# EAGLE design pH-meter-v1-3 (EAGLE 6.1)
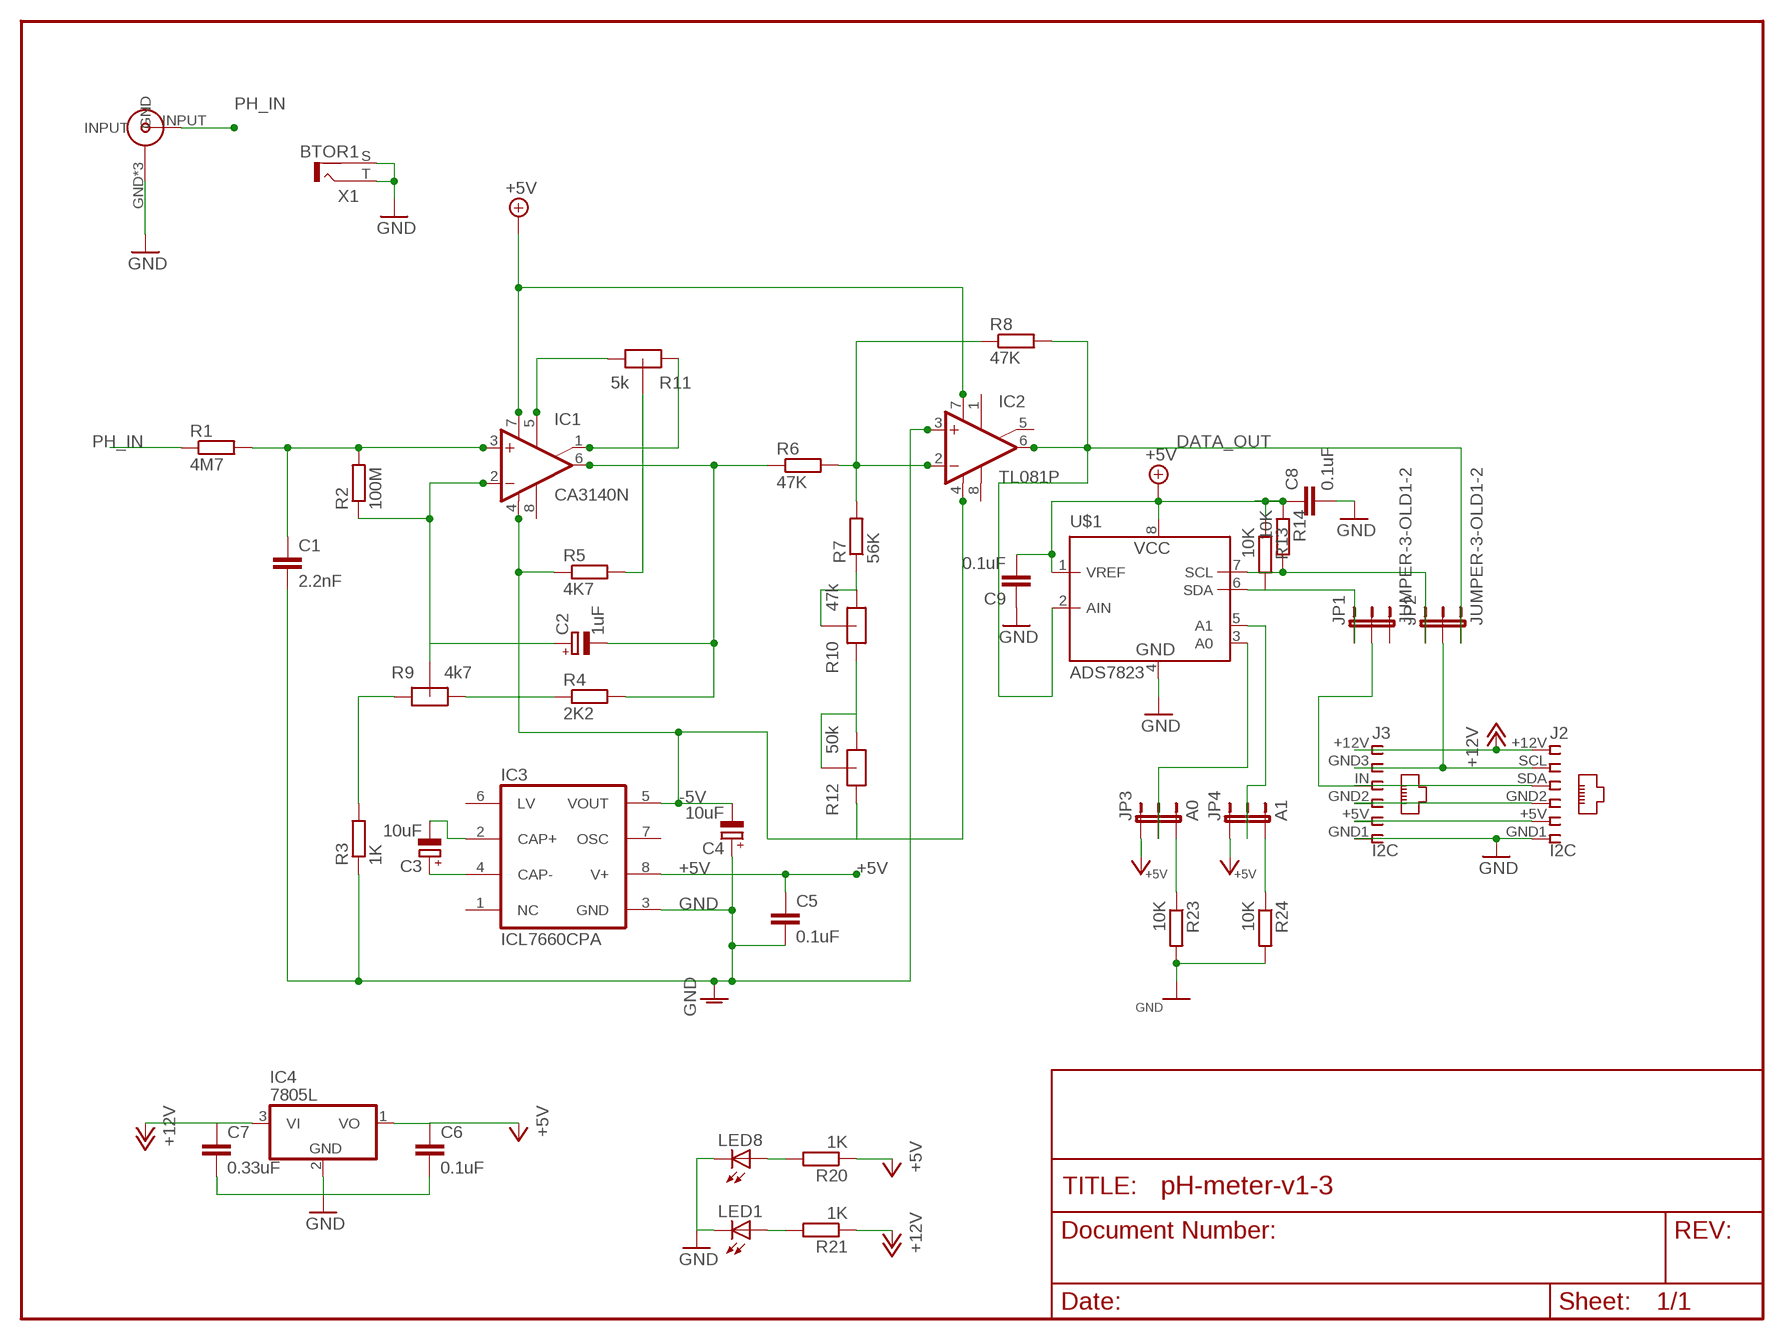
[diagram p0: schematic, sheet 1]

## Parts
C1  2.2nF  C-EU025-030X050  [C025-030X050]
C2  1uF  CPOL-EUE2-4  [E2-4]
C3  10uF  CPOL-EUE2-4  [E2-4]
C4  10uF  CPOL-EUE2-4  [E2-4]
C5  0.1uF  C-EU025-030X050  [C025-030X050]
C6  0.1uF  C-EU025-030X050  [C025-030X050]
C7  0.33uF  C-EU025-030X050  [C025-030X050]
C8  0.1uF  C-EU025-030X050  [C025-030X050]
C9  0.1uF  C-EU025-030X050  [C025-030X050]
IC1  CA3140N  [DIL08]
IC2  TL081P  [DIL08]
IC3  ICL7660CPA  [DIL08]
IC4  7805L  [TO92]
J2  I2C  RJ12STRAIGHT-I2C  [RJ12-STRAIGHT-I2C]
J3  I2C  RJ12STRAIGHT-ANALOG  [RJ12-STRAIGHT-ANALOG]
JP1  JUMPER-3-OLD1-2  [SJ_3_PASTE1&2]
JP2  JUMPER-3-OLD1-2  [SJ_3_PASTE1&2]
JP3  A0  JUMPER-3-OLD1-2  [SJ_3_PASTE1&2]
JP4  A1  JUMPER-3-OLD1-2  [SJ_3_PASTE1&2]
LED1  LED3MM  [LED3MM]
LED8  LED3MM  [LED3MM]
R1  4M7  R-EU_0309/12  [0309/12]
R2  100M  R-EU_0309/12  [0309/12]
R3  1K  R-EU_0309/12  [0309/12]
R4  2K2  R-EU_0309/12  [0309/12]
R5  4K7  R-EU_0309/12  [0309/12]
R6  47K  R-EU_0309/12  [0309/12]
R7  56K  R-EU_0309/12  [0309/12]
R8  47K  R-EU_0309/12  [0309/12]
R9  4k7  POT-METER_ALPS  [POT-METER_ALPS]
R10  47k  POT-METER_ALPS  [POT-METER_ALPS]
R11  5k  POT-METER_ALPS  [POT-METER_ALPS]
R12  50k  POT-METER_ALPS  [POT-METER_ALPS]
R13  10K  R-EU_R1206  [R1206]
R14  10K  R-EU_R1206  [R1206]
R20  1K  R-EU_0309/12  [0309/12]
R21  1K  R-EU_0309/12  [0309/12]
R23  10K  R-EU_0309/12  [0309/12]
R24  10K  R-EU_0309/12  [0309/12]
U$1  ADS7823  [MSOP8]
U$2  BNC_IN  BND_VERTICAL_AMPHENOL  [BNC_VERTICAL_AMPHENOL]
X1  BTOR1  [BTOR1]

## Nets
+5V: C5.1 C6.1 C8.1 C9.2 IC1.7(V+) IC2.7(V+) IC3.8(V+) IC4.1(VO) JP3.1 JP4.1 R13.1 R14.1 R20.1 U$1.1(VREF) U$1.8(VCC)
+12V [highpower]: C7.1 IC4.3(VI) J2.+12V J3.+12V R21.1
-5V: C4.- IC1.4(V-) IC2.4(V-) IC3.5(VOUT) R5.1 R12.P$1(IN)
ASDF: R3.2 R9.P$1(IN)
DATA_OUT [smd]: IC2.6(OUT) JP2.3 R8.2 U$1.2(AIN)
GND [highpower]: C1.2 C4.+ C5.2 C6.2 C7.2 C8.2 C9.1 IC2.3(+IN) IC3.3(GND) IC4.2(GND) J2.GND1 J2.GND2 J3.GND1 J3.GND2 LED1.K(C) LED8.K(C) R3.1 R23.2 R24.2 U$1.4(GND) U$2.GND U$2.GND_1(GND) U$2.GND_2(GND) X1.S X1.T
N$1: C1.1 IC1.3(+IN) R1.2 R2.2
N$2: C2.+ IC1.2(-IN) R2.1 R9.P$2(DRIVE)
N$3: R5.2 R11.P$2(DRIVE)
N$4: IC1.5(ON) R11.P$3(OUT)
N$5: IC1.1(ON/CMP) R11.P$1(IN)
N$6: C2.- IC1.6(OUT) R4.2 R6.1
N$7: R4.1 R9.P$3(OUT)
N$8: R7.1 R10.P$2(DRIVE) R10.P$3(OUT)
N$10: R10.P$1(IN) R12.P$2(DRIVE) R12.P$3(OUT)
N$11: C3.- IC3.2(CAP+)
N$12: IC2.2(-IN) R6.2 R7.2 R8.1
N$13: C3.+ IC3.4(CAP-)
N$14 [smd]: JP1.1 R13.2 U$1.6(SDA)
N$15 [smd]: JP2.1 R14.2 U$1.7(SCL)
N$18 [smd]: JP3.3 R23.1
N$19 [smd]: JP4.3 R24.1
N$20: LED8.A R20.2
N$21 [smd]: JP3.2 U$1.3(A0)
N$22 [smd]: JP4.2 U$1.5(A1)
N$23: LED1.A R21.2
PH_IN: R1.1 U$2.INPUT
RJ12-5V [highpower]: J2.+5V J3.+5V
SCL [smd]: J2.SCL J3.GND3 JP2.2
SDA [smd]: J2.SDA J3.IN JP1.2
Unconnected: IC1.8(CMP) IC2.1(ON1) IC2.5(ON2) IC2.8(OPT) IC3.1(NC) IC3.6(LV) IC3.7(OSC) JP1.3 X1.S@1 X1.S@2 X1.S@3

## Library data of the parts
C1 C5-C9 = resistor:C-EU: CAPACITOR, European symbol
C2-C4 = resistor:CPOL-EU: POLARIZED CAPACITOR, European symbol
IC1 = linear:CA3140: OP AMP
IC2 = linear:TL081: OP AMP
IC3 = maxim:ICL7660CPA: VOLTAGE CONVERTER; MF: INTERSIL; MPN: ICL7660CPA; OC_FARNELL: 1018170; OC_NEWARK: 06F7441
IC4 = linear:78*: Positive VOLTAGE REGULATOR Source: http://cache.national.com/ds/LM/LM78L05.pdf http://www.fairchildsemi.com/ds/LM/LM7805.pdf
J2 J3 = lpatiny:RJ12: CORCOM Modular RJ Jacks No Shield Source: www.tycoelectronics.com .. ENG_DS_1654001_1099_RJ_L_0507.pdf
JP1-JP4 = SparkFun:JUMPER-3-OLD
LED1 LED8 = lpatiny:LED3MM
R1-R8 R13 R14 R20 R21 R23 R24 = rcl:R-EU_: RESISTOR, European symbol
R9-R12 = lpatiny:POT-METER_ALPS
U$1 = lpatiny:ADS7823
U$2 = lpatiny:BND_VERTICAL_AMPHENOL
X1 = con-lumberg:BTOR1: RCA connectors according to JEITA RC-5231 Cinch RCA-Einbaukupplung nach JEITA RC-5231, stehende Ausführung Source: http://www.lumberg.de/Produkte/PDFs/BTOR1.pdf; MPN: BTOR 1; OC_FARNELL: 1217030; OC_NEWARK: 96K7172

## Net classes
0 default: width 0.457 mm
1 smd: width 0.203 mm
2 highpower: width 0.61 mm

## Board
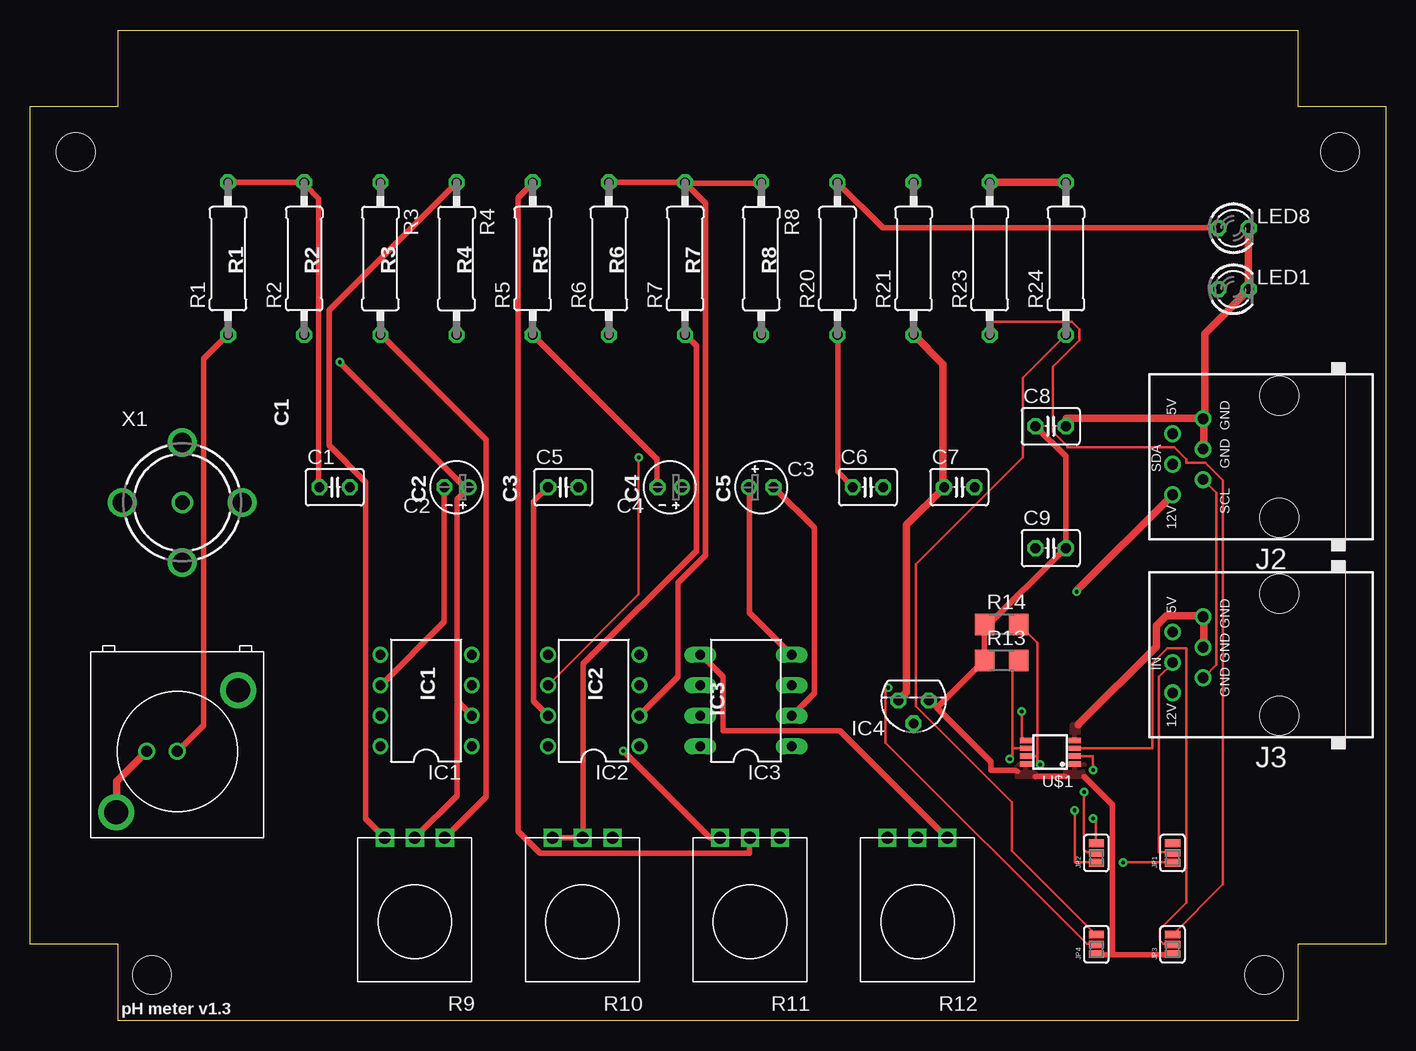
[diagram p1: board, top side]
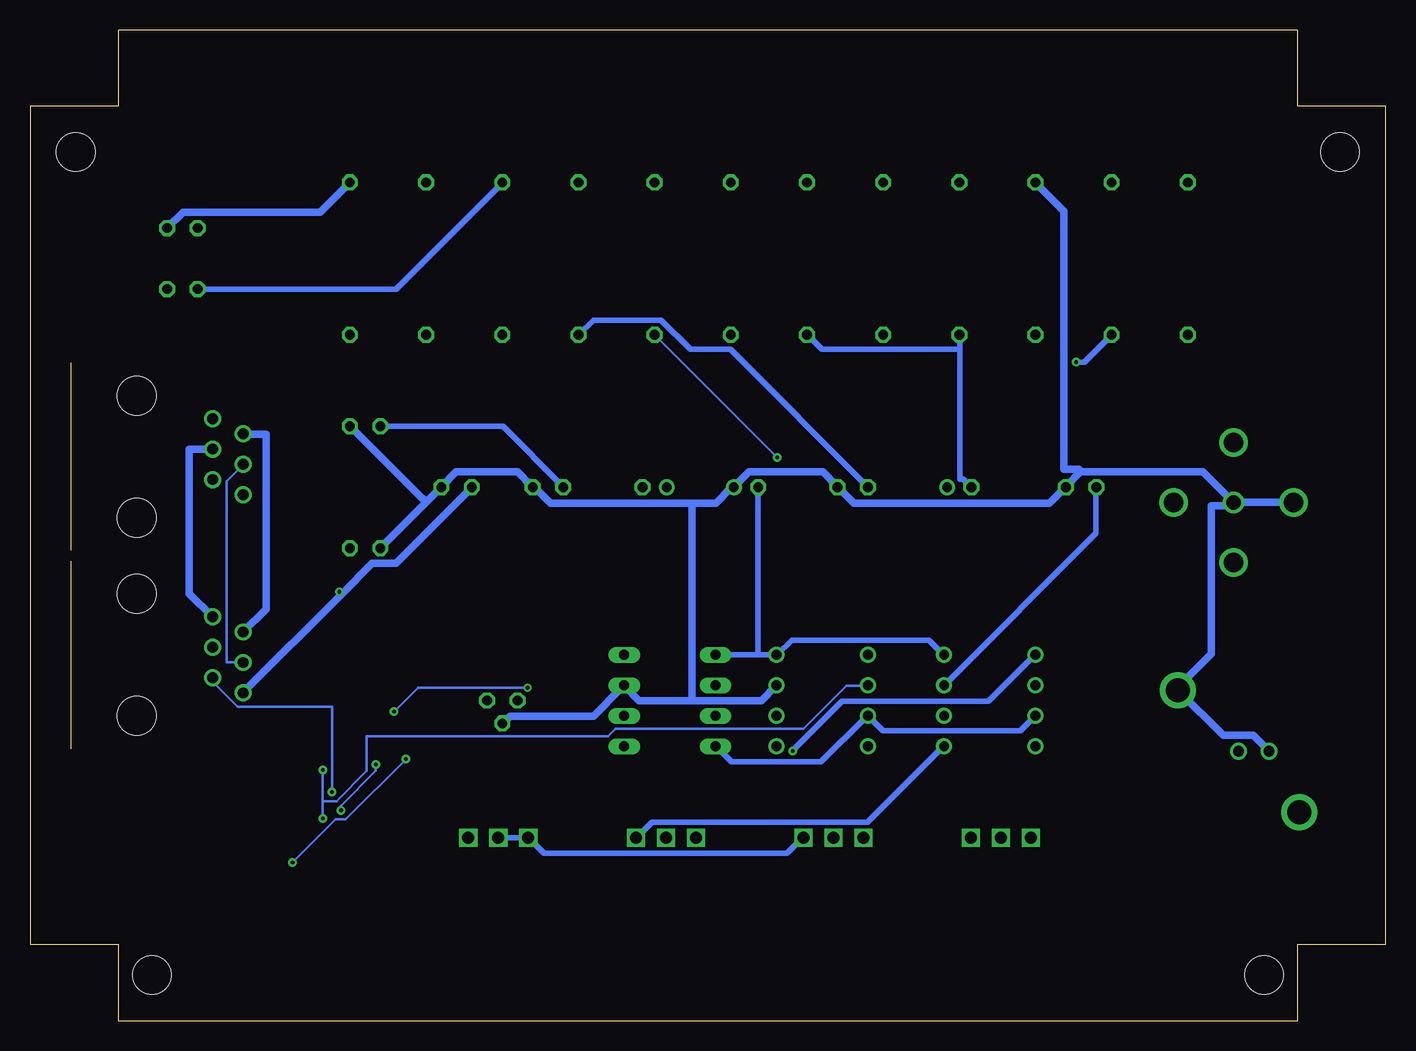
[diagram p2: board, bottom side, seen from below]

Size 113.03 x 82.55 mm. Coordinates in mm from the lower left corner, seen from the top.
Outline: 0,76.2 7.35,76.2 7.35,82.55 105.68,82.55 105.68,76.2 113.03,76.2 113.03,6.35 105.68,6.35 105.68,0 7.35,0 7.35,6.35 0,6.35 0,76.2
Copper layers (1*16): Top 0.035mm / dielectric 1.5mm / Bottom 0.035mm
Design rules: minimum track width 0.15mm, minimum drill 0.3mm, track to track 0.3mm, track to pad 0.3mm, pad to pad 0.3mm, via to via 0.3mm, smd to smd 0.3mm, copper to edge 1mm, drill to drill 0.3mm, minimum pad ring 10mil, minimum via ring 8mil, stop-mask expansion 4mil, vias tented up to drill 0mil, thermal gap 10mil
Holes 3.2 mm at 3.81,72.39 10.16,3.81 102.87,3.81 109.22,72.39
Milling: 12 lines

### Footprints (pad centres in the part's own frame; a part is rotated, then mirrored left to right if it is on the bottom)
C025-030X050 = drill 0.813 octagon: 1 -1.27,0; 2 1.27,0
E2-4 = drill 0.813 pad 1.27: + -1.016,0 | drill 0.813 pad 1.27 octagon: - 1.016,0
DIL08 = drill 0.813 pad 1.27: 1 -3.81,-3.81; 2 -1.27,-3.81; 3 1.27,-3.81; 4 3.81,-3.81; 5 3.81,3.81; 6 1.27,3.81; 7 -1.27,3.81; 8 -3.81,3.81
DIL08' = drill 0.813 long: 1 -3.81,-3.81; 2 -1.27,-3.81; 3 1.27,-3.81; 4 3.81,-3.81; 5 3.81,3.81; 6 1.27,3.81; 7 -1.27,3.81; 8 -3.81,3.81
TO92 = drill 0.813 octagon: 1 -1.27,0; 2 0,1.905; 3 1.27,0
RJ12-STRAIGHT-I2C = drill 0.9 pad 1.4: +5V 1.905,8.89; +12V -3.175,8.89; GND1 3.175,6.35; GND2 0.635,6.35; SCL -1.905,6.35; SDA -0.635,8.89 | hole 3.251: -5.08,0; 5.08,0
RJ12-STRAIGHT-ANALOG = drill 0.9 pad 1.4: +5V 1.905,8.89; +12V -3.175,8.89; GND1 3.175,6.35; GND2 0.635,6.35; GND3 -1.905,6.35; IN -0.635,8.89 | hole 3.251: -5.08,0; 5.08,0
SJ_3_PASTE1&2 = smd 0.635 x 1.27: 1 -0.813,0; 2 0,0; 3 0.813,0
LED3MM = drill 0.813 octagon: A -1.27,0; K 1.27,0
0309/12 = drill 0.813 octagon: 1 -6.35,0; 2 6.35,0
POT-METER_ALPS = drill 1 square: P$1 2.25,0; P$2 4.75,0; P$3 7.25,0
R1206 = smd 1.6 x 1.803: 1 -1.422,0; 2 1.422,0
MSOP8 = smd 0.45 x 1: 1 -0.975,-2.05; 2 -0.325,-2.05; 3 0.325,-2.05; 4 0.975,-2.05; 5 0.975,2.05; 6 0.325,2.05; 7 -0.325,2.05; 8 -0.975,2.05
BNC_VERTICAL_AMPHENOL = drill 0.9: GND 4.66,7.2; INPUT 7.2,7.2 | drill 2: GND_1 12.28,12.28; GND_2 2.12,2.12
BTOR1 = drill 1.6 pad 2.2: S -5,0; S@1 0,5; S@2 5,0; S@3 0,-5 | drill 1.2 pad 1.6: T 0,0

### Placement (x,y rotation side)
C1  25.4,44.45 0 top
C2  35.56,44.45 180 top
C3  60.96,44.45 0 top
C4  53.34,44.45 180 top
C5  44.45,44.45 0 top
C6  69.85,44.45 0 top
C7  77.47,44.45 0 top
C8  85.09,49.53 0 top
C9  85.09,39.37 0 top
IC1  33.02,26.67 90 top
IC2  46.99,26.67 90 top
IC3  ICL7660CPA  [DIL08']  59.69,26.67 90 top
IC4  73.66,26.67 180 top
J2  104.14,46.99 90 top
J3  104.14,30.48 90 top
JP1  95.25,13.97 90 top
JP2  88.9,13.97 90 top
JP3  95.25,6.35 90 top
JP4  88.9,6.35 90 top
LED1  100.33,60.96 0 top
LED8  100.33,66.04 0 top
R1  16.51,63.5 90 top
R2  22.86,63.5 90 top
R3  29.21,63.5 270 top
R4  35.56,63.5 270 top
R5  41.91,63.5 90 top
R6  48.26,63.5 90 top
R7  54.61,63.5 90 top
R8  60.96,63.5 270 top
R9  36.83,15.24 180 top
R10  50.8,15.24 180 top
R11  64.77,15.24 180 top
R12  78.74,15.24 180 top
R13  81,30 0 top
R14  81,33 0 top
R20  67.31,63.5 90 top
R21  73.66,63.5 90 top
R23  80.01,63.5 90 top
R24  86.36,63.5 90 top
U$1  85.06,22.37 90 top
U$2  5.08,15.24 0 top
X1  12.7,43.18 0 top

### Tracks (layer width: path | path; a pad name or v marks a point on that pad's centre or on a via)
+5V
  Top 0.457: C5.1 43.13,44.42 41.99,43.28 41.99,26.59 43.13,25.45 IC2.7 | C6.1 68.58,44.5 67.36,45.72 67.36,57.15 R20.1 | C8.1 86.33,47.02 86.33,39.4 C9.2 86.18,39.24 79.7,32.77 R14.1 79.55,32.99 79.55,30.02 R13.1 79.4,29.87 75.74,26.21 75.59,26.06 | 90.22,5.49 95.25,5.49 JP3.1 | 90.22,5.49 88.92,5.49 JP4.1 | 83.82,20.32 83.97,20.34 86.18,20.34 86.36,20.32 | 75.59,26.06 74.98,26.67 IC4.1 | 75.59,26.06 80.09,21.57 80.09,20.88 82.14,20.88 82.3,20.76 | 90.22,5.49 90.22,5.64 90.22,17.98 88.01,20.19 87.88,20.32
  Bottom 0.457: IC1.7 29.26,25.38 30.48,24.16 41.91,24.16 43.13,25.38 IC2.7 43.36,25.3 47.09,21.57 54.56,21.57 55.85,22.86 IC3.8 | C8.1 73.61,49.53 68.58,44.5 C6.1 | C5.1 43.2,44.5 54.63,55.93 57.99,55.93 60.43,58.37 66.06,58.37 67.28,57.15 R20.1
  pour Top: 82.3,21.34 83.82,21.34 83.82,20.32 82.3,20.32
  pour Top: 87.38,21.34 87.88,21.34 87.88,20.32 86.36,20.32 86.36,21.34
+12V  (via drill 0.3)
  Top 0.61: IC4.3 73.08,27.36 73.08,41.3 76.2,44.42 C7.1 76.12,44.73 76.12,54.71 73.69,57.15 R21.1 | J2.+12V 87.25,35.81 v87.25,35.74
  Bottom 0.61: 87.06,35.55 84.51,38.1 82.53,38.1 76.2,44.42 C7.1 | 87.06,35.55 95.25,27.36 J3.+12V | v87.25,35.74 87.06,35.55
-5V
  Top 0.457: R5.1 52.27,46.79 52.27,44.5 C4.- | R12.P$1 76.43,15.24 67.51,24.16 57.76,24.16 57.76,28.65 55.93,30.48 IC3.5
  Bottom 0.457: IC1.4 36.88,30.48 38.1,31.7 49.53,31.7 50.75,30.48 IC2.4 50.98,30.48 52.35,30.48 | 52.35,30.48 55.85,30.48 IC3.5 | C4.- 52.35,44.42 52.35,30.63 52.35,30.48
ASDF
  Top 0.457: R3.2 29.26,57.15 38.02,48.39 38.02,18.67 34.59,15.24 R9.P$1
DATA_OUT  (via drill 0.3)
  Top 0.203: v88.62,20.88 88.62,22.02 87.17,22.02 U$1.2 | v88.62,16.84 88.85,16.61 88.85,14.78 JP2.3 | v50.75,46.94 50.75,35.51 43.2,27.96 IC2.6
  Bottom 0.203: v88.62,16.84 88.62,18.29 | 88.62,18.29 v88.62,20.88 | R8.2 v50.75,46.94 | 88.62,18.29 88.54,18.29 87.48,18.29 84.96,20.8 84.96,23.7 64.85,23.7 64.24,24.31 48.54,24.31 44.96,27.89 43.2,27.89 IC2.6
GND
  Top 0.61: U$2.GND 9.68,22.4 7.24,19.96 7.24,17.37 U$2.GND_2 | 87.38,24.64 87.48,24.77 93.88,31.17 93.88,32.92 94.72,33.76 97.77,33.76 97.77,33.68 J3.GND1 97.84,33.38 97.84,31.17 J3.GND2 | R23.2 80.01,69.88 86.33,69.88 R24.2 | LED8.K 101.58,65.99 101.58,60.96 LED1.K 101.42,60.73 97.92,57.23 97.92,50.44 J2.GND1 | J2.GND2 97.84,47.62 97.84,50.14 J2.GND1 | J2.GND1 97.54,50.22 86.41,50.22 86.41,49.53 C8.2
  Bottom 0.61: U$2.GND 9.75,22.48 11.05,23.77 13.56,23.77 17.3,27.51 U$2.GND_1 17.3,27.81 14.55,30.56 14.55,42.9 12.8,42.9 X1.T | 25.45,45.72 26.67,44.5 C1.2 26.9,44.27 28.04,43.13 44.35,43.13 45.49,44.27 C5.2 45.72,44.5 46.94,45.72 53.11,45.72 54.33,44.5 C4.+ 54.63,44.35 55.85,43.13 57.84,43.13 | 25.45,45.72 15.24,45.72 12.72,43.2 X1.T | R3.1 29.18,69.8 26.82,67.44 26.82,45.95 25.6,45.95 25.45,45.72 | X1.S 7.77,43.2 12.42,43.2 X1.T | 57.84,26.67 62.26,26.67 63.48,27.89 IC3.3 63.7,27.74 66.06,25.38 73,25.38 73.61,24.77 IC4.2 | 57.84,26.67 52.05,26.67 50.83,27.89 IC2.3 | 79.97,43.24 78.94,44.27 C7.2 78.72,44.5 77.5,45.72 72.39,45.72 71.17,44.5 C6.2 70.87,44.35 69.65,43.13 57.84,43.13 | 79.97,43.24 83.82,39.4 C9.1 | C8.2 86.33,49.53 80.24,43.43 80.16,43.43 79.97,43.24 | R24.2 86.41,69.8 88.85,67.36 100.28,67.36 101.58,66.06 LED8.K | J3.GND1 97.84,33.68 99.75,35.59 99.75,47.62 97.84,47.62 J2.GND2 | 57.84,26.67 57.84,26.9 57.84,42.9 57.84,43.13
  pour Top: 87.38,23.37 87.38,24.64 86.87,24.64 86.87,23.37
N$1
  Top 0.457: R1.2 16.54,69.88 22.86,69.88 R2.2 22.94,69.65 24.08,68.5 24.08,44.5 C1.1
  Bottom 0.457: IC1.3 36.8,27.96 24.16,40.62 24.16,44.42 C1.1
N$2  (via drill 0.3)
  Top 0.457: 35.74,26.52 36.8,25.45 IC1.2 | 35.74,26.52 35.59,26.67 35.59,43.43 36.58,44.42 C2.+ 36.27,44.42 v25.83,54.86 | R9.P$2 35.59,18.75 35.59,26.36 35.74,26.52 | R9.P$2
  Bottom 0.457: R2.1 25.15,54.86 v25.83,54.86
N$3
  Top 0.457: R5.2 41.91,69.8 40.69,68.58 40.69,15.77 42.52,13.95 59.97,13.95 59.97,15.24 R11.P$2
N$4  (via drill 0.3)
  Top 0.457: v49.45,22.48 56.69,15.24 57.45,15.24 R11.P$3
  Bottom 0.457: v49.45,22.48 45.34,26.59 33.15,26.59 29.26,30.48 IC1.5
N$5
  Bottom 0.457: IC1.1 36.88,22.86 43.2,16.54 61.19,16.54 62.48,15.24 R11.P$1
N$6
  Top 0.457: IC1.6 29.26,27.96 34.52,33.22 34.52,44.42 C2.-
  Bottom 0.457: 35.51,55.93 35.51,45.11 35.2,45.11 34.59,44.5 C2.- | 35.51,55.93 35.51,57.15 R4.2 | R6.1 48.23,57.15 47.02,55.93 35.66,55.93 35.51,55.93
N$7
  Top 0.457: R4.1 35.51,69.8 24.92,59.21 24.92,47.93 27.96,44.88 27.96,16.84 29.57,15.24 R9.P$3
N$8
  Top 0.457: R7.1 54.63,57.15 55.55,56.24 55.55,39.17 46.1,29.72 46.1,15.24 R10.P$2 45.87,15.24 43.59,15.24 R10.P$3
N$10
  Bottom 0.457: R10.P$1 48.62,15.24 49.91,13.95 70.18,13.95 71.48,15.24 R12.P$3 71.7,15.24 73.91,15.24 R12.P$2
N$11
  Top 0.457: IC3.2 63.55,25.45 65.38,27.28 65.38,41.07 62.03,44.42 C3.-
N$12
  Top 0.457: IC2.2 50.83,25.45 54.03,28.65 54.03,36.5 56.31,38.79 56.31,68.12 54.63,69.8 R7.2 | R6.2 48.31,69.88 54.41,69.88 R7.2 | R8.1 60.96,69.8 54.94,69.8 R7.2
N$13
  Top 0.457: IC3.4 63.48,30.48 59.97,33.98 59.97,44.42 C3.+
N$14  (via drill 0.3)
  Top 0.203: 81.92,22.71 82.98,22.71 U$1.6 | 81.92,22.71 81.92,29.49 82.37,29.95 R13.2 | v91.14,13.18 95.25,13.18 JP1.1 | v81.69,21.79 81.92,22.02 81.92,22.63 81.92,22.71
  Bottom 0.203: v91.14,13.18 87.55,16.76 86.72,16.76 v81.69,21.79
N$15  (via drill 0.3)
  Top 0.203: 83.97,22.02 83.06,22.02 U$1.7 | 83.97,22.02 83.97,31.47 82.45,32.99 R14.2 | v87.1,17.53 87.1,13.18 88.85,13.18 JP2.1 | v84.2,21.34 83.97,21.57 83.97,21.95 83.97,22.02
  Bottom 0.203: v87.1,17.53 87.1,17.91 84.2,20.8 v84.2,21.34
N$18
  Top 0.203: JP3.3 99.44,11.35 99.44,45.03 97.99,46.48 96.39,46.48 96.39,46.79 95.4,47.78 86.49,47.78 86.49,47.85 85.27,49.07 85.27,54.48 87.48,56.69 87.48,57.61 86.87,58.22 80.01,58.22 R23.1
N$19
  Top 0.203: JP4.3 88.85,7.16 81.84,14.17 81.84,18.21 73.84,26.21 73.84,38.02 82.75,46.94 82.75,53.57 86.33,57.15 R24.1
N$20
  Top 0.457: R20.2 67.36,69.8 71.09,66.06 99.06,66.06 LED8.A
N$21
  Top 0.203: U$1.3 87.17,22.71 93.57,22.71 93.57,29.79 94.79,31.01 96.39,31.01 96.39,9.83 94.18,7.62 94.18,6.71 94.49,6.4 95.25,6.4 JP3.2
N$22  (via drill 0.3)
  Top 0.203: v82.68,25.76 82.68,23.7 82.98,23.39 U$1.5 | v71.55,27.74 71.32,27.51 71.32,23.16 88.09,6.4 88.85,6.4 JP4.2
  Bottom 0.203: v82.68,25.76 80.7,27.74 v71.55,27.74
N$23
  Bottom 0.457: LED1.A 82.53,60.96 73.69,69.8 R21.2
PH_IN
  Top 0.457: R1.1 16.46,57.15 14.48,55.17 14.48,24.61 12.34,22.48 U$2.INPUT
RJ12-5V
  Bottom 0.61: J3.+5V 93.34,34.29 93.34,48.84 95.25,48.84 J2.+5V
SCL  (via drill 0.3)
  Top 0.203: v87.86,19.05 87.86,14.25 88.09,14.02 88.85,14.02 JP2.2 | J2.SCL 97.84,45.03 98.91,43.97 98.91,29.64 97.84,28.57 J3.GND3
  Bottom 0.203: v87.86,19.05 87.86,26.14 95.71,26.14 97.77,28.19 97.77,28.57 J3.GND3
SDA
  Top 0.203: JP1.2 95.25,14.02 94.11,14.02 94.11,28.65 95.25,29.79 J3.IN
  Bottom 0.203: J2.SDA 95.25,46.33 96.62,44.96 96.62,29.87 95.25,29.87 J3.IN

### Text on the board
tPlace: R1 | R2 | R3 | R4 | R5 | R6 | R7 | R8 | C1 | C2 | C3 | C4 | C5 | IC1 | IC2 | IC3 | pH meter v1.3